# Altium schematic sheet 03-M2_GoldFingers.SchDoc
size B; SheetNumber: 3; SheetTotal: 3
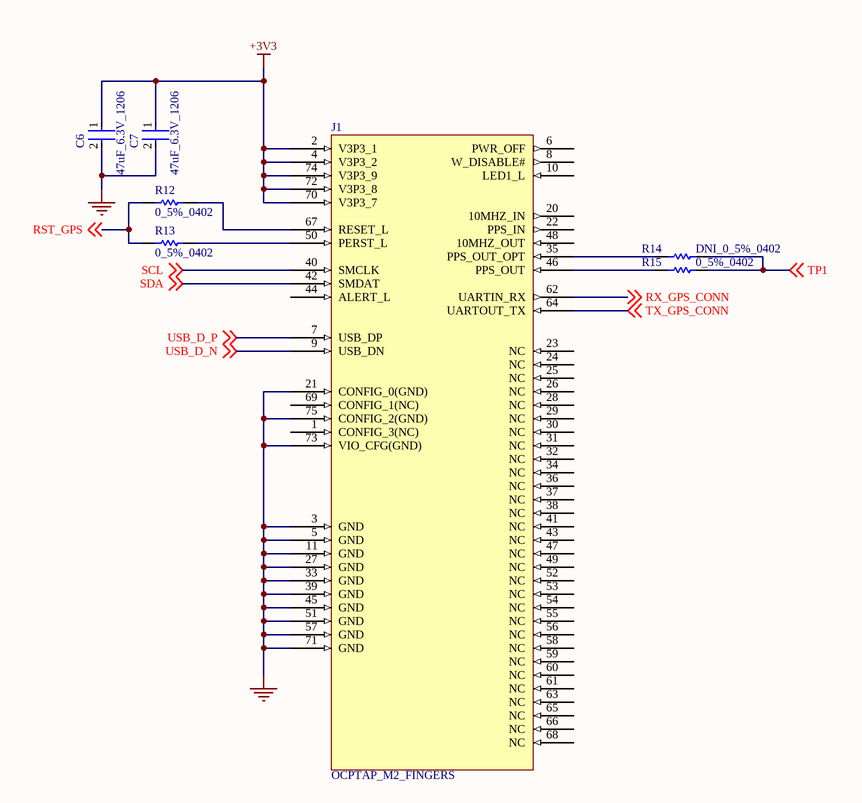
[diagram p0: 03-M2_GoldFingers.SchDoc]

## Parts
C6  47uF_6.3V_1206  [FP-GRM31C-0_2-e0_3_0_8-IPC_C]
C7  47uF_6.3V_1206  [FP-GRM31C-0_2-e0_3_0_8-IPC_C]
J1  OCPTAP_M2_FINGERS  [OCPTAP M2 FINGERS]  (no BOM)
R12  0_5%_0402  [RESC1005X40X25NL05T10]
R13  0_5%_0402  [RESC1005X40X25NL05T10]
R14  DNI_0_5%_0402  [RESC1005X40X25NL05T10]  (no BOM)
R15  0_5%_0402  [RESC1005X40X25NL05T10]

## Nets
+3V3: C6.1 C7.1 J1.2(V3P3_1) J1.4(V3P3_2) J1.70(V3P3_7) J1.72(V3P3_8) J1.74(V3P3_9)
GND: C6.2 C7.2 J1.3(GND) J1.5(GND) J1.11(GND) J1.21(CONFIG_0(GND)) J1.27(GND) J1.33(GND) J1.39(GND) J1.45(GND) J1.51(GND) J1.57(GND) J1.71(GND) J1.73(VIO_CFG(GND)) J1.75(CONFIG_2(GND))
RST_GPS: R12.1 R13.1 ; off-sheet RST_GPS
RX_GPS_CONN: J1.62(UARTIN_RX) ; off-sheet RX_GPS_CONN
SCL: J1.40(SMCLK) ; off-sheet SCL
SDA: J1.42(SMDAT) ; off-sheet SDA
TP1: R14.2 R15.2 ; off-sheet TP1
TX_GPS_CONN: J1.64(UARTOUT_TX) ; off-sheet TX_GPS_CONN
USB_D_N: J1.9(USB_DN) ; off-sheet USB_D_N
USB_D_P: J1.7(USB_DP) ; off-sheet USB_D_P
NetJ1_35: J1.35(PPS_OUT_OPT) R14.1
NetJ1_46: J1.46(PPS_OUT) R15.1
NetJ1_50: J1.50(PERST_L) R13.2
NetJ1_67: J1.67(RESET_L) R12.2

Not connected (* = marked no-connect by the designer): J1 1(CONFIG_3(NC)) 6(PWR_OFF) 8(W_DISABLE#) 10(LED1_L) 20(10MHZ_IN) 22(PPS_IN) 23(NC) 24(NC) 25(NC) 26(NC) 28(NC) 29(NC) 30(NC) 31(NC) 32(NC) 34(NC) 36(NC) 37(NC) 38(NC) 41(NC) 43(NC) 44(ALERT_L) 47(NC) 48(10MHZ_OUT) 49(NC) 52(NC) 53(NC) 54(NC) 55(NC) 56(NC) 58(NC) 59(NC) 60(NC) 61(NC) 63(NC) 65(NC) 66(NC) 68(NC) 69(CONFIG_1(NC))

## Library data of the parts
C6 C7 = CMP-2000-06344-2: Chip Multilayer Ceramic Capacitors for General Purpose, 1206, 47uF, X5R, 15%, 20%, 6.3V; Package Quantity: 2000; Mount: Surface Mount; Length: 3.2mm; Thickness: 0.071inch; Lead Free: Lead Free; Tolerance: 20%; Width: 0.063inch; Depth: 1.6mm; Case/Package: 1206; Dielectric: X5R; Radiation Hardening: No; Packaging: Tape and Reel; Voltage Rating (DC): 6.3V; Termination: SMD/SMT; Height: 1.6mm; Max Operating Temperature: 85°C; Case Code (Metric): 3216; Case Code (Imperial): 1206; Voltage: 6.3V; Voltage Rating: 6.3V; Capacitance: 47uF; Min Operating Temperature: -55°C; Material: Ceramic; REACH SVHC: No SVHC
R12-R15 = CMP-2002-06457-1: Manufacturer: Panasonic; Part Number: ERJ-U020R00X